# EAGLE schematic 02A-001 Input Switch (EAGLE 6.3)
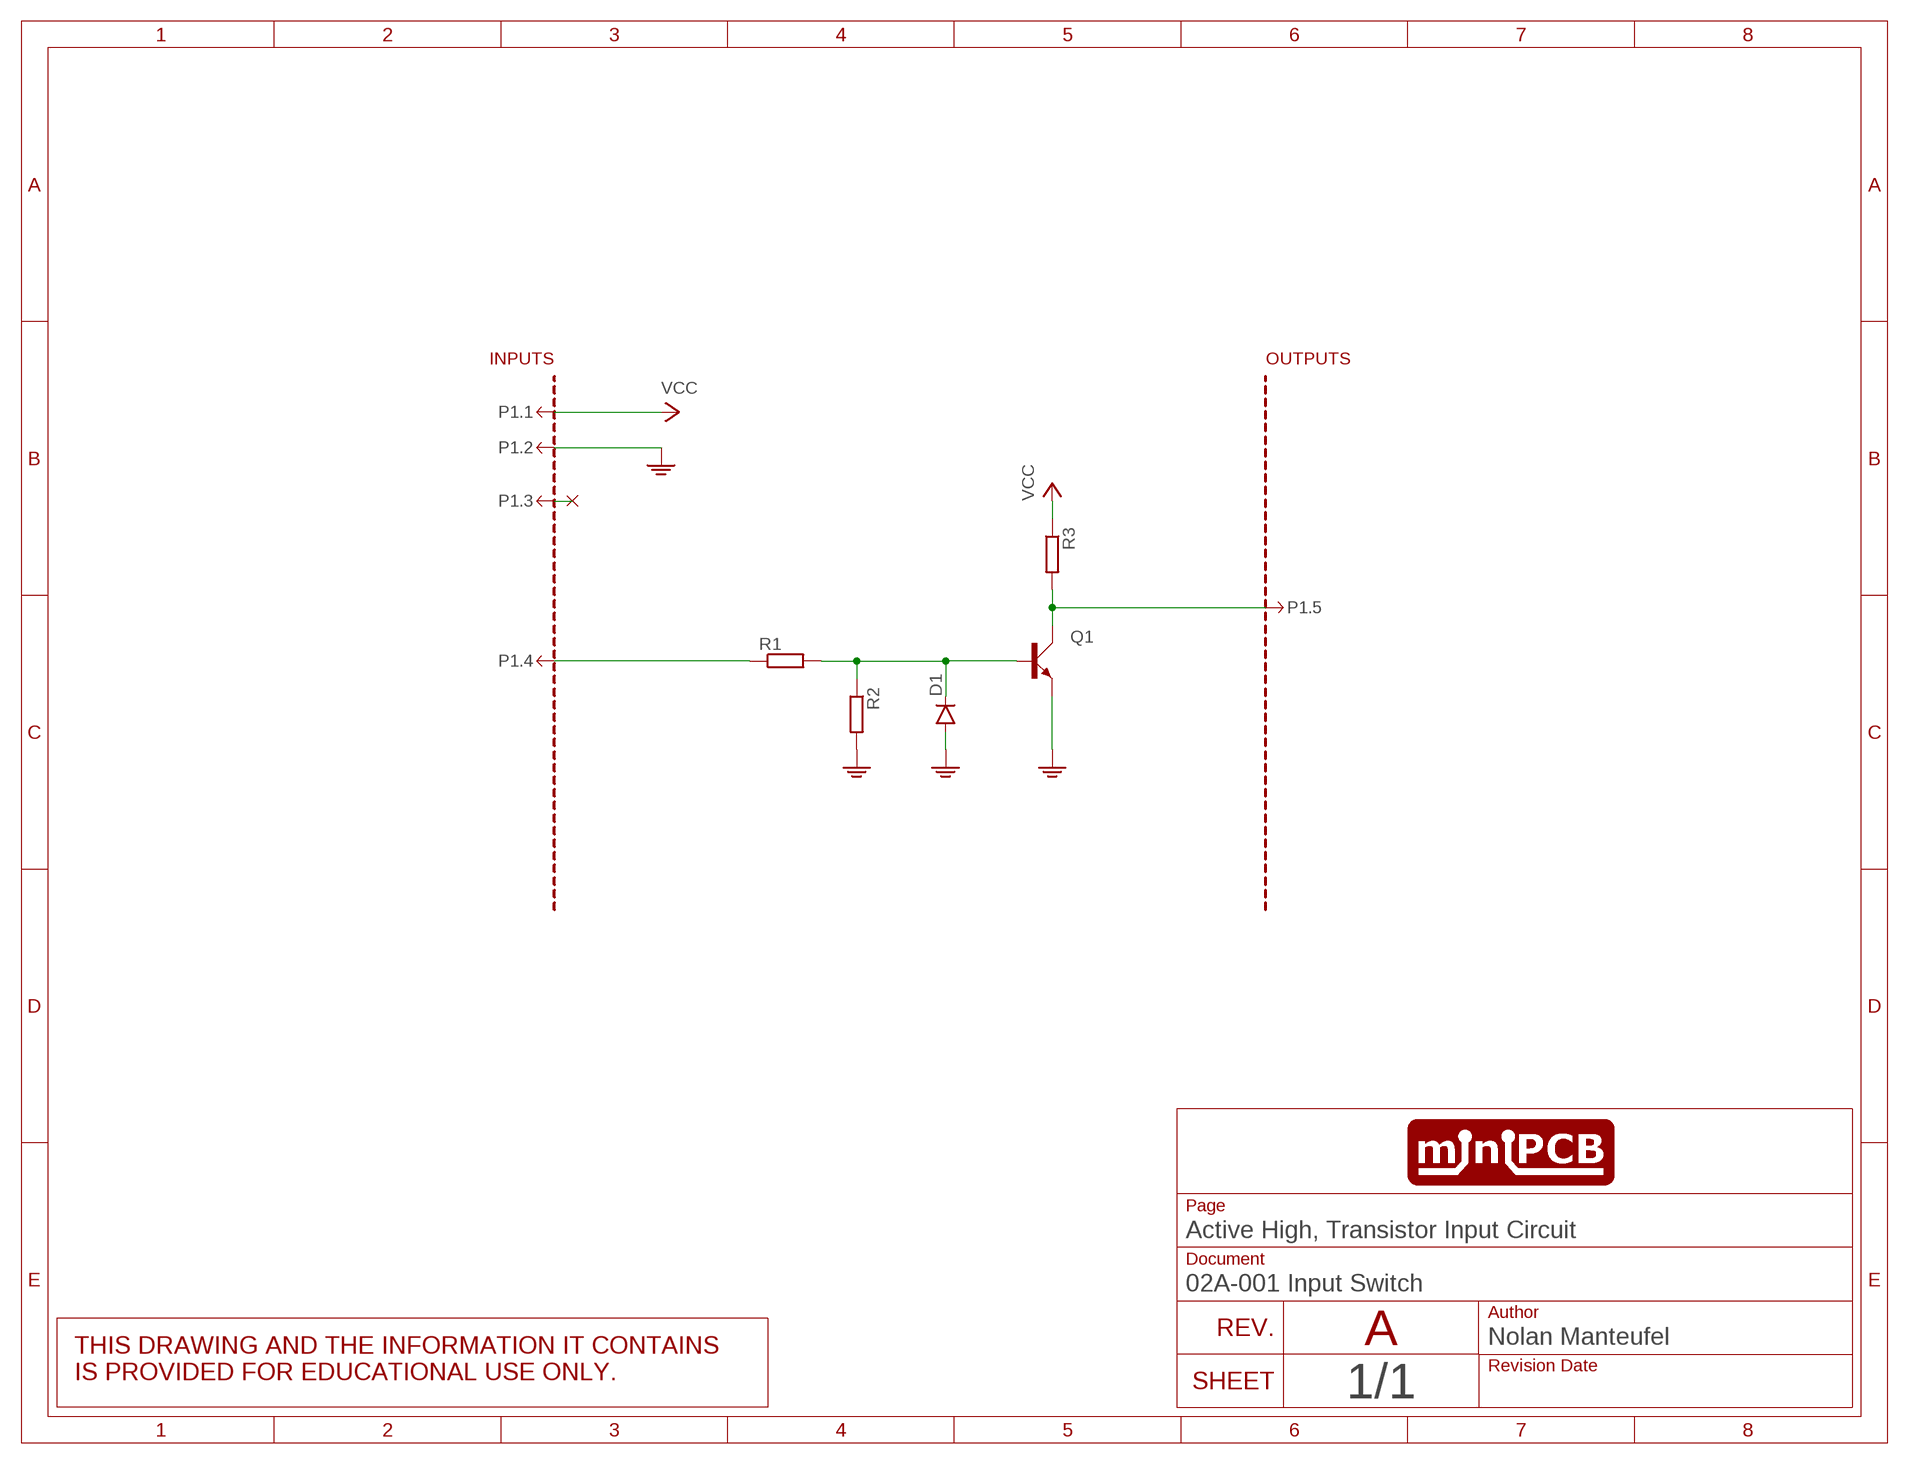
[diagram p0: schematic, sheet 1]

## Parts
D1  DIODE-SOD80C  [SOD80C]
P1.  MINIPCB_4INCH  [PCB_5]
Q1  BJT_NPNBEC  [SOT23]
R1  R-EU_R0805  [R0805]
R2  R-EU_R0805  [R0805]
R3  R-EU_R0805  [R0805]

## Nets
GND: D1.A P1..1 Q1.2(E) R2.2
INPUT: P1..4 R1.1
N$1: D1.C Q1.1(B) R1.2 R2.1
N$2: P1..3
OUTPUT: P1..5 Q1.3(C) R3.2
VCC: P1..2 R3.1

## Notes on the sheet
- A

## Library data of the parts
D1 = nolan:DIODE-: DIODE
P1. = nolan:MINIPCB_4INCH
Q1 = nolan:BJT_NPN
R1-R3 = nolan:R-EU_: RESISTOR, European symbol